# Altium schematic sheet video_switch.SchDoc
size A3; SheetNumber: 2; SheetTotal: 6
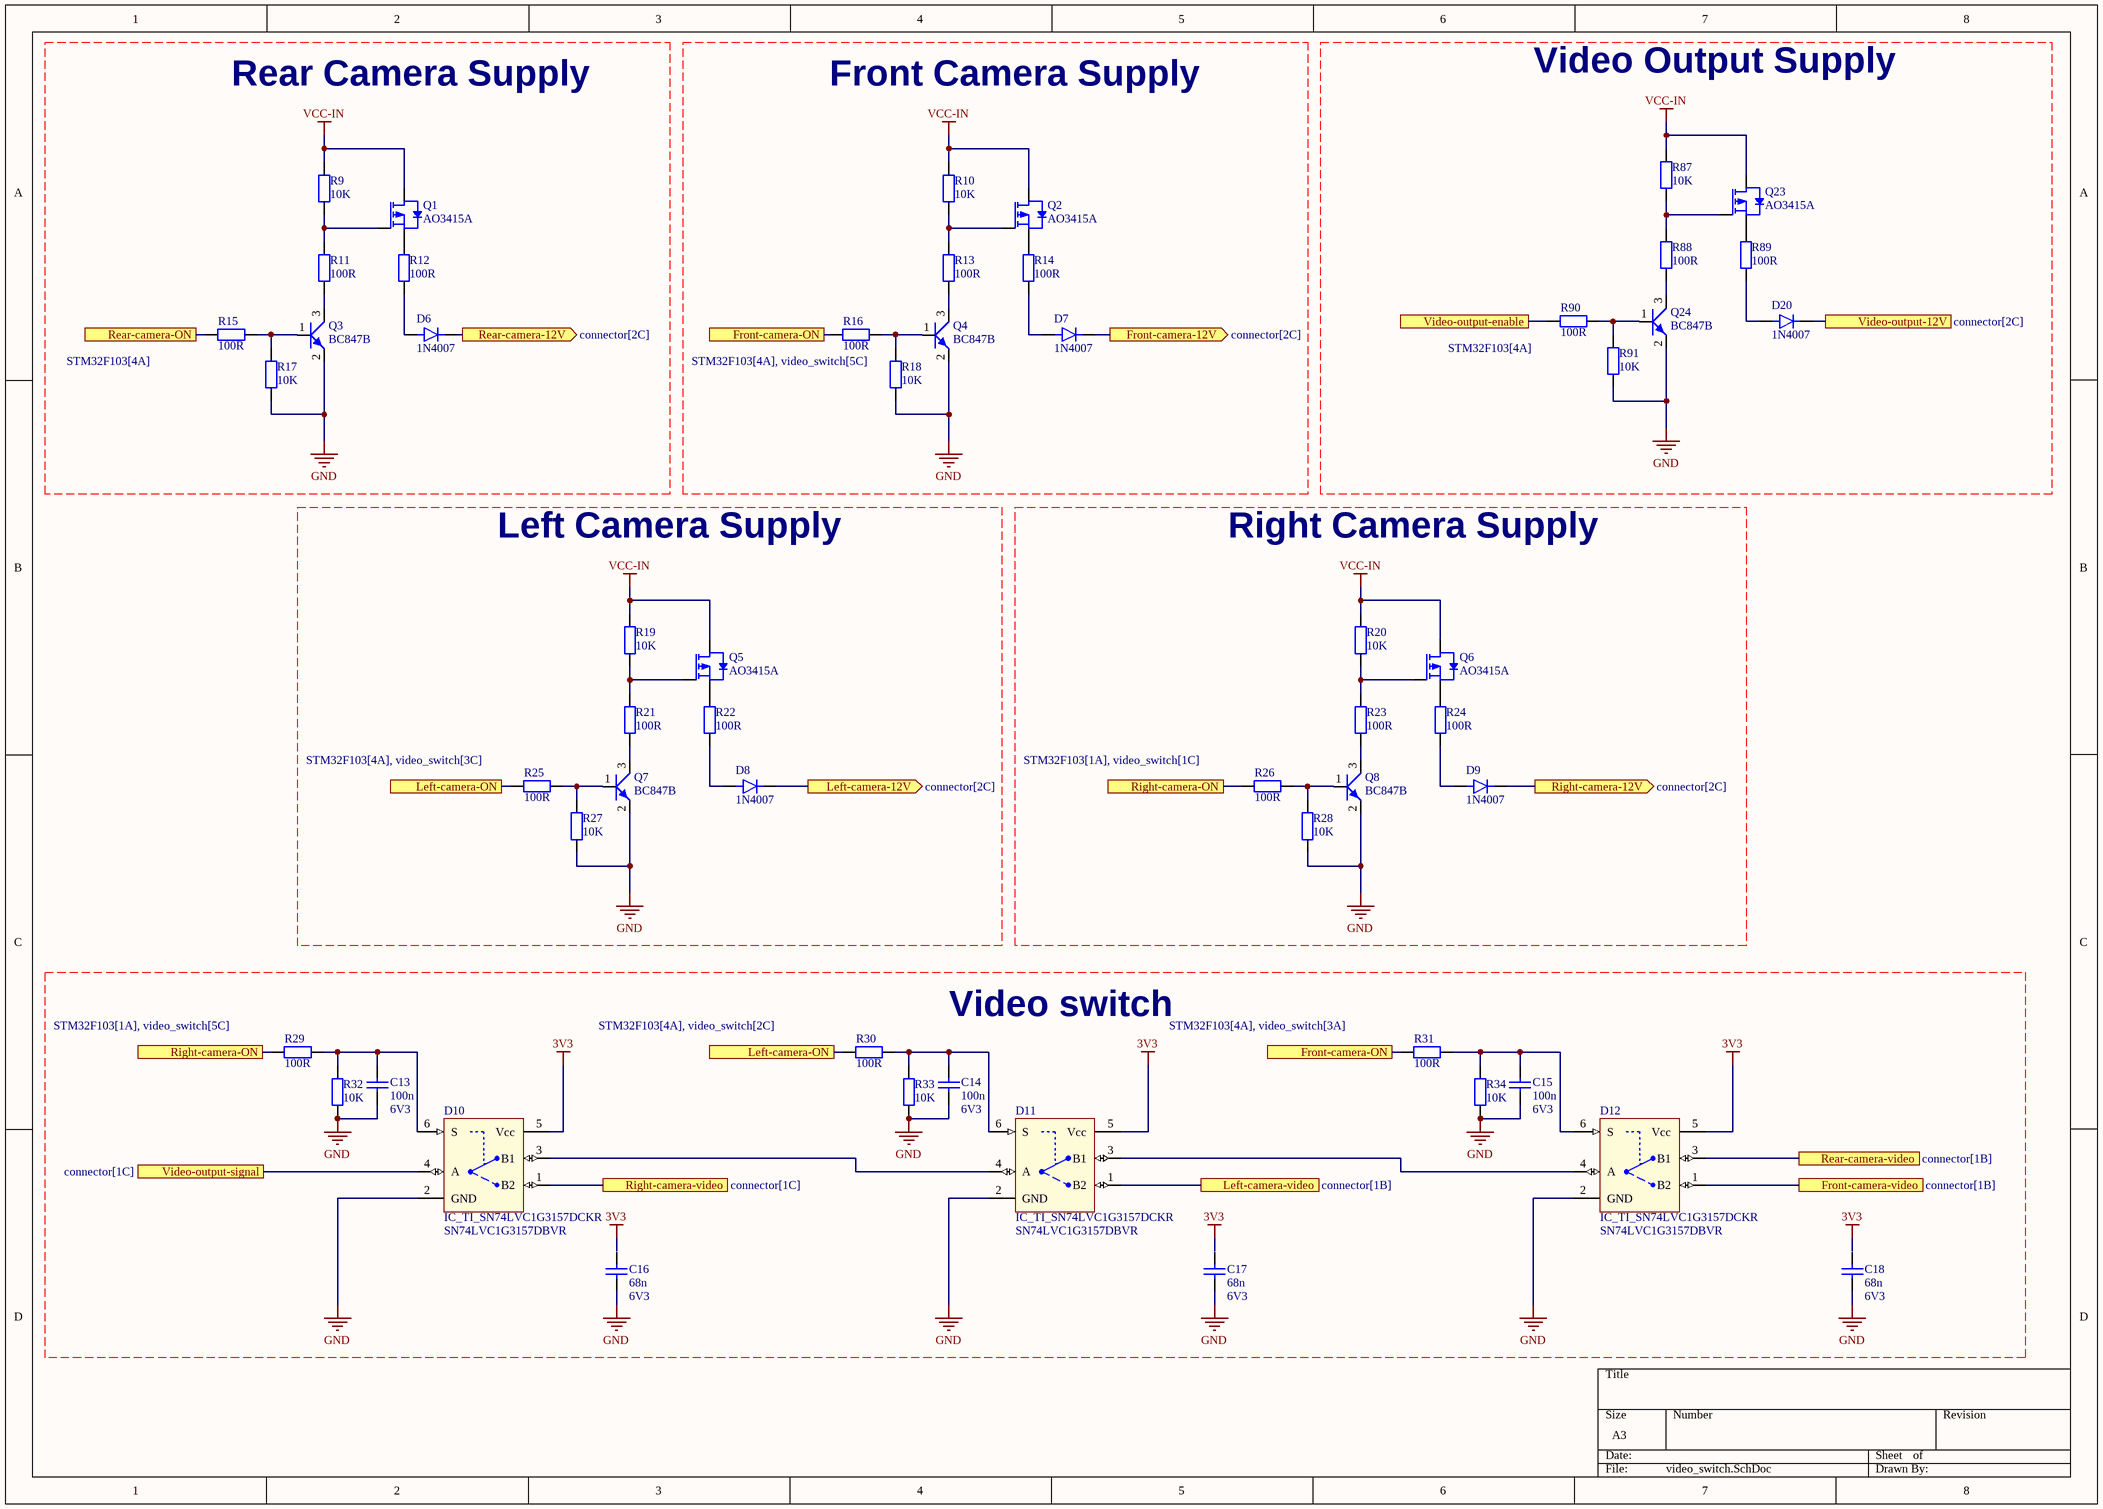
[diagram p0: video_switch.SchDoc]

## Parts
C13  Value1: 100n  Value2: 6V3  [CAPC2012X88N]  (hidden comment: CAP)
C14  Value1: 100n  Value2: 6V3  [CAPC2012X88N]  (hidden comment: CAP)
C15  Value1: 100n  Value2: 6V3  [CAPC2012X88N]  (hidden comment: CAP)
C16  Value1: 68n  Value2: 6V3  [CAPC2012X100N]  (hidden comment: CAP)
C17  Value1: 68n  Value2: 6V3  [CAPC2012X100N]  (hidden comment: CAP)
C18  Value1: 68n  Value2: 6V3  [CAPC2012X100N]  (hidden comment: CAP)
D6  Value1: 1N4007  [DO-214AC]  (hidden comment: DIO)
D7  Value1: 1N4007  [DO-214AC]  (hidden comment: DIO)
D8  Value1: 1N4007  [DO-214AC]  (hidden comment: DIO)
D9  Value1: 1N4007  [DO-214AC]  (hidden comment: DIO)
D10  IC_TI_SN74LVC1G3157DCKR  Value1: SN74LVC1G3157DBVR  [SOT23-6N]
D11  IC_TI_SN74LVC1G3157DCKR  Value1: SN74LVC1G3157DBVR  [SOT23-6N]
D12  IC_TI_SN74LVC1G3157DCKR  Value1: SN74LVC1G3157DBVR  [SOT23-6N]
D20  Value1: 1N4007  [DO-214AC]  (hidden comment: DIO)
Q1  Value1: AO3415A  [SOT23]  (hidden comment: TRS_FETP_123)
Q2  Value1: AO3415A  [SOT23]  (hidden comment: TRS_FETP_123)
Q3  Value1: BC847B  [SOT23]  (hidden comment: TRS_NPN_123)
Q4  Value1: BC847B  [SOT23]  (hidden comment: TRS_NPN_123)
Q5  Value1: AO3415A  [SOT23]  (hidden comment: TRS_FETP_123)
Q6  Value1: AO3415A  [SOT23]  (hidden comment: TRS_FETP_123)
Q7  Value1: BC847B  [SOT23]  (hidden comment: TRS_NPN_123)
Q8  Value1: BC847B  [SOT23]  (hidden comment: TRS_NPN_123)
Q23  Value1: AO3415A  [SOT23]  (hidden comment: TRS_FETP_123)
Q24  Value1: BC847B  [SOT23]  (hidden comment: TRS_NPN_123)
R9  Value1: 10K  [RESC2012X60N]  (hidden comment: RES)
R10  Value1: 10K  [RESC2012X60N]  (hidden comment: RES)
R11  Value1: 100R  [RESC2012X60N]  (hidden comment: RES)
R12  Value1: 100R  [RESC2012X60N]  (hidden comment: RES)
R13  Value1: 100R  [RESC2012X60N]  (hidden comment: RES)
R14  Value1: 100R  [RESC2012X60N]  (hidden comment: RES)
R15  Value1: 100R  [RESC2012X60N]  (hidden comment: RES)
R16  Value1: 100R  [RESC2012X60N]  (hidden comment: RES)
R17  Value1: 10K  [RESC2012X60N]  (hidden comment: RES)
R18  Value1: 10K  [RESC2012X60N]  (hidden comment: RES)
R19  Value1: 10K  [RESC2012X60N]  (hidden comment: RES)
R20  Value1: 10K  [RESC2012X60N]  (hidden comment: RES)
R21  Value1: 100R  [RESC2012X60N]  (hidden comment: RES)
R22  Value1: 100R  [RESC2012X60N]  (hidden comment: RES)
R23  Value1: 100R  [RESC2012X60N]  (hidden comment: RES)
R24  Value1: 100R  [RESC2012X60N]  (hidden comment: RES)
R25  Value1: 100R  [RESC2012X60N]  (hidden comment: RES)
R26  Value1: 100R  [RESC2012X60N]  (hidden comment: RES)
R27  Value1: 10K  [RESC2012X60N]  (hidden comment: RES)
R28  Value1: 10K  [RESC2012X60N]  (hidden comment: RES)
R29  Value1: 100R  [RESC2012X60N]  (hidden comment: RES)
R30  Value1: 100R  [RESC2012X60N]  (hidden comment: RES)
R31  Value1: 100R  [RESC2012X60N]  (hidden comment: RES)
R32  Value1: 10K  [RESC2012X60N]  (hidden comment: RES)
R33  Value1: 10K  [RESC2012X60N]  (hidden comment: RES)
R34  Value1: 10K  [RESC2012X60N]  (hidden comment: RES)
R87  Value1: 10K  [RESC2012X60N]  (hidden comment: RES)
R88  Value1: 100R  [RESC2012X60N]  (hidden comment: RES)
R89  Value1: 100R  [RESC2012X60N]  (hidden comment: RES)
R90  Value1: 100R  [RESC2012X60N]  (hidden comment: RES)
R91  Value1: 10K  [RESC2012X60N]  (hidden comment: RES)

## Ports
Front-camera-12V (out, see connector[2C]), Front-camera-ON (see STM32F103[4A], video_switch[3A]), Front-camera-ON (see STM32F103[4A], video_switch[5C]), Front-camera-video (see connector[1B]), Left-camera-12V (out, see connector[2C]), Left-camera-ON (see STM32F103[4A], video_switch[2C]), Left-camera-ON (see STM32F103[4A], video_switch[3C]), Left-camera-video (see connector[1B]), Rear-camera-12V (out, see connector[2C]), Rear-camera-ON (see STM32F103[4A]), Rear-camera-video (see connector[1B]), Right-camera-12V (out, see connector[2C]), Right-camera-ON (see STM32F103[1A], video_switch[1C]), Right-camera-ON (see STM32F103[1A], video_switch[5C]), Right-camera-video (see connector[1C]), Video-output-12V (see connector[2C]), Video-output-enable (see STM32F103[4A]), Video-output-signal (see connector[1C])

## Nets
3V3: D10.5(Vcc) D11.5(Vcc) D12.5(Vcc)
GND: C13.1 C14.1 C15.1 C16.1 C17.1 C18.1 D10.2(GND) D11.2(GND) D12.2(GND) Q3.2(E) Q4.2(E) Q7.2(E) Q8.2(E) Q24.2(E) R17.1 R18.1 R27.1 R28.1 R32.1 R33.1 R34.1 R91.1
VCC-IN: Q1.3(D) Q2.3(D) Q5.3(D) Q6.3(D) Q23.3(D) R9.2 R10.2 R19.2 R20.2 R87.2
Front-camera-12V: D7.2(K) ; port Front-camera-12V
Front-camera-ON: R16.1 R31.1 ; port Front-camera-ON
Front-camera-video: D12.1(B2) ; port Front-camera-video
Left-camera-12V: D8.2(K) ; port Left-camera-12V
Left-camera-ON: R25.1 R30.1 ; port Left-camera-ON
Left-camera-video: D11.1(B2) ; port Left-camera-video
Rear-camera-12V: D6.2(K) ; port Rear-camera-12V
Rear-camera-ON: R15.1 ; port Rear-camera-ON
Rear-camera-video: D12.3(B1) ; port Rear-camera-video
Right-camera-12V: D9.2(K) ; port Right-camera-12V
Right-camera-ON: R26.1 R29.1 ; port Right-camera-ON
Right-camera-video: D10.1(B2) ; port Right-camera-video
Video-output-12V: D20.2(K) ; port Video-output-12V
Video-output-enable: R90.1 ; port Video-output-enable
Video-output-signal: D10.4(A) ; port Video-output-signal
NetC13_2: C13.2 D10.6(S) R29.2 R32.2
NetC14_2: C14.2 D11.6(S) R30.2 R33.2
NetC15_2: C15.2 D12.6(S) R31.2 R34.2
NetD6_1: D6.1(A) R12.1
NetD7_1: D7.1(A) R14.1
NetD8_1: D8.1(A) R22.1
NetD9_1: D9.1(A) R24.1
NetD10_3: D10.3(B1) D11.4(A)
NetD11_3: D11.3(B1) D12.4(A)
NetD20_1: D20.1(A) R89.1
NetQ1_1: Q1.1(G) R9.1 R11.2
NetQ1_2: Q1.2(S) R12.2
NetQ2_1: Q2.1(G) R10.1 R13.2
NetQ2_2: Q2.2(S) R14.2
NetQ3_1: Q3.1(B) R15.2 R17.2
NetQ3_3: Q3.3(C) R11.1
NetQ4_1: Q4.1(B) R16.2 R18.2
NetQ4_3: Q4.3(C) R13.1
NetQ5_1: Q5.1(G) R19.1 R21.2
NetQ5_2: Q5.2(S) R22.2
NetQ6_1: Q6.1(G) R20.1 R23.2
NetQ6_2: Q6.2(S) R24.2
NetQ7_1: Q7.1(B) R25.2 R27.2
NetQ7_3: Q7.3(C) R21.1
NetQ8_1: Q8.1(B) R26.2 R28.2
NetQ8_3: Q8.3(C) R23.1
NetQ23_1: Q23.1(G) R87.1 R88.2
NetQ23_2: Q23.2(S) R89.2
NetQ24_1: Q24.1(B) R90.2 R91.2
NetQ24_3: Q24.3(C) R88.1

Not connected (* = marked no-connect by the designer): C16 2; C17 2; C18 2

## Notes on the sheet
- Rear Camera Supply
- Front Camera Supply
- Video Output Supply
- Left Camera Supply
- Right Camera Supply
- Video switch

## Library data of the parts
C13-C15 = 01_00637: X7R 10% 0805; Manufacturer: KEMET; Manufacturer PN: C0805C104K9RACTU; AutoId: 637; DeviceType: capacitor; SubType: Ceramic; Id: 01_00637; Status: 2 - Checked and Approved; MountType: SMT; ComponentLink1URL: X:\01_Datasheets\CAP_KEMET_CxxxxCxxxXxRAC.pdf; Supplier 1: Farnell; Supplier Part Number 1: 80-C0805C104K9R; ComponentLink1Description: Datasheet
C16-C18 = 01_00635: X7R 10% 0805; Manufacturer: KEMET; Manufacturer PN: C0805C683K9RACTU; AutoId: 635; DeviceType: capacitor; SubType: Ceramic; Id: 01_00635; Status: 2 - Checked and Approved; MountType: SMT; ComponentLink1URL: X:\01_Datasheets\CAP_KEMET_CxxxxCxxxXxRAC.pdf; Supplier 1: Farnell; ComponentLink1Description: Datasheet
D6-D9 D20 = 03_00099: M7 Diode, max 30A; AutoId: 117; Value2: 1A, 400V; Id: 03_00099; Value3: M7; Manufacturer PN: 1N4007; DeviceType: diode; ComponentLink1Description: Datasheet; ComponentLink1URL: X:\01_Datasheets\; ComponentLink2Description: ComponentVerificationSheet; ComponentLink2URL: X:\02_ComponentVerificationSheets\
D10-D12 = 07_00286: Single-Pole Double-Throw Analog Switch; Manufacturer: TI; AutoId: 293; DeviceType: IC; Id: 07_00286; Value2: Analog Switch; Manufacturer PN: SN74LVC1G3157DBVR; Status: 0 - Unchecked; MountType: SMT; ComponentLink1Description: Datasheet; ComponentLink1URL: X:\01_Datasheets\; ComponentLink2Description: ComponentVerificationSheet; ComponentLink2URL: X:\02_ComponentVerificationSheets\; Supplier 1: Imrad; Supplier Part Number 1: 135309
Q1 Q2 Q5 Q6 Q23 = 19_00051: 20V P-Channel MOSFET; Manufacturer: Alpha & Omega; AutoId: 58; Value2: 20V, 4A; DeviceType: transistor; SubType: P MOSFET; Id: 19_00051; Manufacturer PN: AO3415A; Status: 0 - Unchecked; MountType: SMT; ComponentLink1Description: Datasheet; ComponentLink1URL: X:\01_Datasheets\AO3415A.pdf; ComponentLink2Description: ComponentVerificationSheet; ComponentLink2URL: X:\02_ComponentVerificationSheets\
Q3 Q4 Q7 Q8 Q24 = 19_00039: Bipolar Transistors - BJT NPN 45V 100mA; Manufacturer: NXP; Manufacturer PN: BC847B,215; AutoId: 39; Value2: 45V 0,1A; Id: 19_00039; DeviceType: transistor; SubType: NPN; Status: 0 - Unchecked; MountType: SMD; ComponentLink1Description: Datasheet; ComponentLink1URL: X:\01_Datasheets\TRS_NXP_BC847.pdf; ComponentLink2Description: ComponentVerificationSheet; ComponentLink2URL: X:\02_ComponentVerificationSheets\; Supplier 1: Mouser; Supplier Part Number 1: 771-BC847B-T/R
R9 R10 R17-R20 R27 R28 R32-R34 R87 R91 = 15_00341: RESISTOR, 0805, 10K, 1%, SMD; Manufacturer: Yageo; Manufacturer PN: RC0805FR-0710K; AutoId: 341; Value2: 0W125; SubType: Metal film; Id: 15_00341; DeviceType: resistor; Status: 0 - Unchecked; MountType: SMT; ComponentLink1Description: Datasheet; ComponentLink1URL: X:\01_Datasheets\RES_YAGEO_RC0805FR.pdf; Supplier 1: Farnell
R11-R16 R21-R26 R29-R31 R88-R90 = 15_00317: RESISTOR, 0805, 100R, 1%, SMD; Manufacturer: Yageo; Manufacturer PN: RC0805FR-07100R; AutoId: 317; Value2: 0W125; SubType: Metal film; Id: 15_00317; DeviceType: resistor; Status: 2 - Checked and Approved; MountType: SMT; ComponentLink1Description: Datasheet; ComponentLink1URL: X:\01_Datasheets\RES_YAGEO_RC0805FR.pdf; Supplier 1: Farnell; Supplier Part Number 1: 9237364